# Altium schematic sheet PLL.SchDoc
size A4
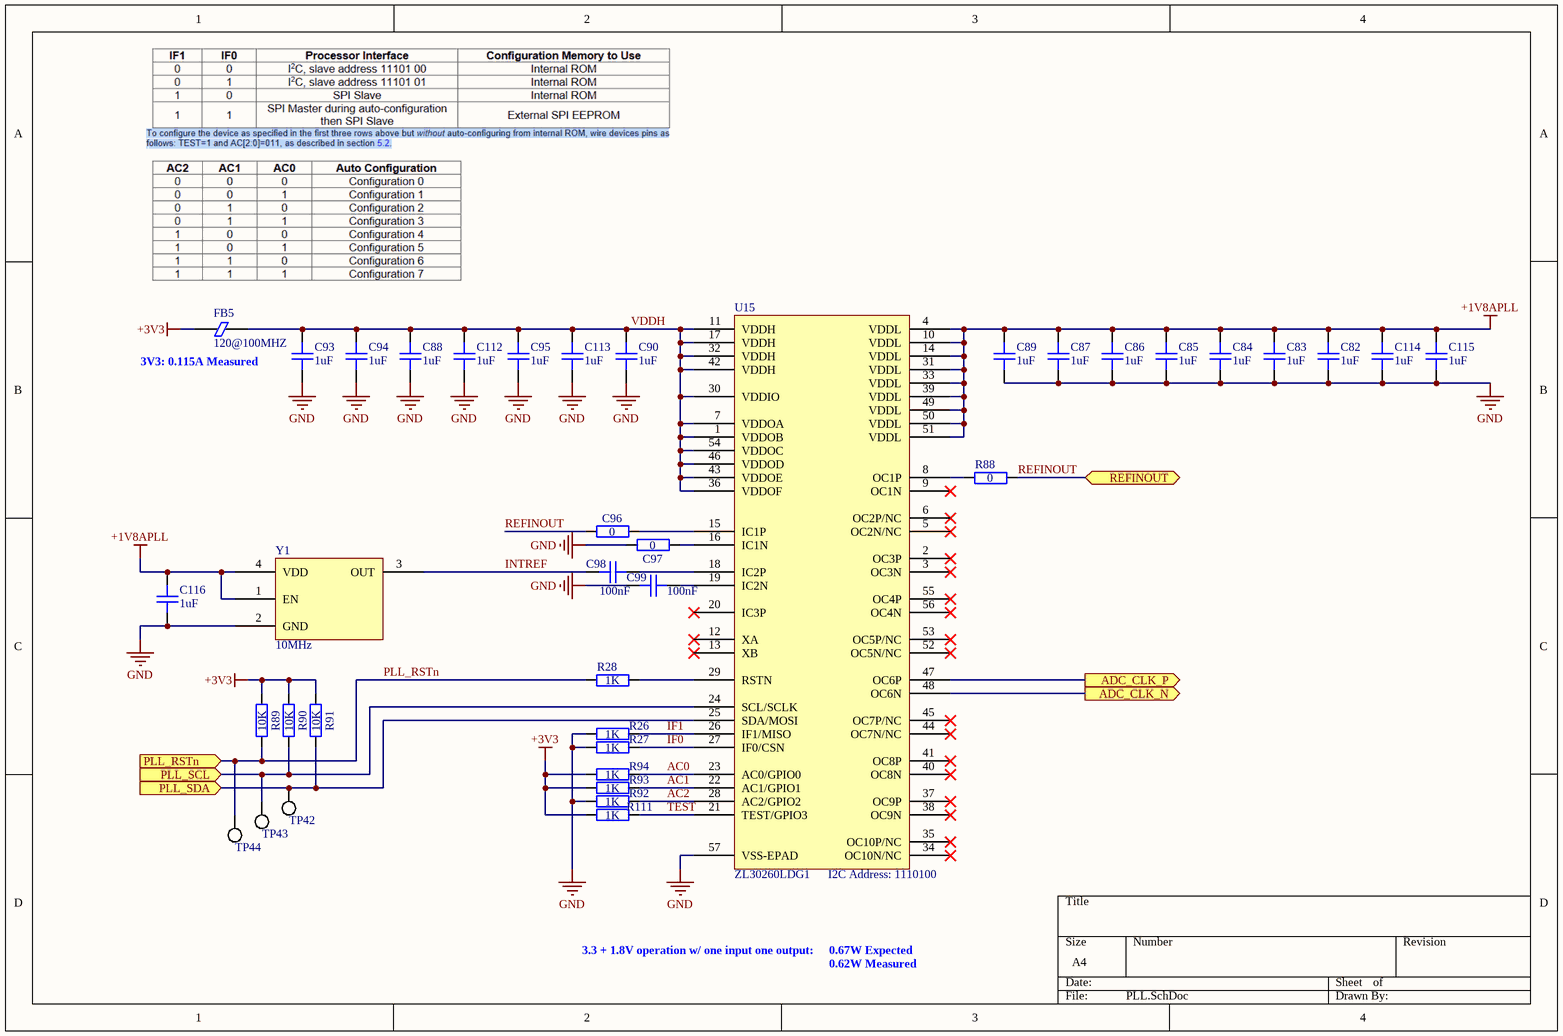
[diagram p0: PLL.SchDoc]

## Parts
C82  1uF  [GEN_C_0402]
C83  1uF  [GEN_C_0402]
C84  1uF  [GEN_C_0402]
C85  1uF  [GEN_C_0402]
C86  1uF  [GEN_C_0402]
C87  1uF  [GEN_C_0402]
C88  1uF  [GEN_C_0402]
C89  1uF  [GEN_C_0402]
C90  1uF  [GEN_C_0402]
C93  1uF  [GEN_C_0402]
C94  1uF  [GEN_C_0402]
C95  1uF  [GEN_C_0402]
C96  0  [GEN_R_0402]
C97  0  [GEN_R_0402]
C98  100nF  [GEN_C_0402]
C99  100nF  [GEN_C_0402]
C112  1uF  [GEN_C_0402]
C113  1uF  [GEN_C_0402]
C114  1uF  [GEN_C_0402]
C115  1uF  [GEN_C_0402]
C116  1uF  [GEN_C_0402]
FB5  120@100MHZ  [GEN_R_0402]
R26  1K  [GEN_R_0402]
R27  1K  [GEN_R_0402]
R28  1K  [GEN_R_0402]
R88  0  [GEN_R_0402]
R89  10K  [GEN_R_0402]
R90  10K  [GEN_R_0402]
R91  10K  [GEN_R_0402]
R92  1K  [GEN_R_0402]
R93  1K  [GEN_R_0402]
R94  1K  [GEN_R_0402]
R111  1K  [GEN_R_0402]
TP42  PCB  [GEN_TP_PCB]  (value not drawn)  (no BOM)
TP43  PCB  [GEN_TP_PCB]  (value not drawn)  (no BOM)
TP44  PCB  [GEN_TP_PCB]  (value not drawn)  (no BOM)
U15  ZL30260LDG1  [MC_QFN56_ZL30260]
Y1  10MHz  [ECS_TXO-3225]

## Ports
ADC_CLK_N (out), ADC_CLK_P (out), PLL_RSTn (in), PLL_SCL (in), PLL_SDA (in), REFINOUT (bidir)

## Nets
+1V8APLL: C82.1 C83.1 C84.1 C85.1 C86.1 C87.1 C89.1 C114.1 C115.1 C116.1 U15.4(VDDL) U15.10(VDDL) U15.14(VDDL) U15.31(VDDL) U15.33(VDDL) U15.39(VDDL) U15.49(VDDL) U15.50(VDDL) U15.51(VDDL) Y1.1(EN) Y1.4(VDD)
+3V3: FB5.1 R89.2 R90.2 R91.2 R93.1 R94.1 R111.1
GND: C82.2 C83.2 C84.2 C85.2 C86.2 C87.2 C88.2 C89.2 C90.2 C93.2 C94.2 C95.2 C97.2 C99.2 C112.2 C113.2 C114.2 C115.2 C116.2 R26.1 R27.1 R92.1 U15.57(VSS-EPAD) Y1.2(GND)
AC0: R94.2 U15.23(AC0/GPIO0)
AC1: R93.2 U15.22(AC1/GPIO1)
AC2: R92.2 U15.28(AC2/GPIO2)
ADC_CLK_N: U15.48(OC6N) ; port ADC_CLK_N
ADC_CLK_P: U15.47(OC6P) ; port ADC_CLK_P
IF0: R27.2 U15.27(IF0/CSN)
IF1: R26.2 U15.26(IF1/MISO)
INTREF: C98.2 Y1.3(OUT)
PLL_RSTn: R28.2 R89.1 TP44.1 ; port PLL_RSTn
PLL_SCL: R90.1 TP43.1 U15.24(SCL/SCLK) ; port PLL_SCL
PLL_SDA: R91.1 TP42.1 U15.25(SDA/MOSI) ; port PLL_SDA
REFINOUT: C96.2 R88.2 ; port REFINOUT
TEST: R111.2 U15.21(TEST/GPIO3)
VDDH: C88.1 C90.1 C93.1 C94.1 C95.1 C112.1 C113.1 FB5.2 U15.1(VDDOB) U15.7(VDDOA) U15.11(VDDH) U15.17(VDDH) U15.30(VDDIO) U15.32(VDDH) U15.36(VDDOF) U15.42(VDDH) U15.43(VDDOE) U15.46(VDDOD) U15.54(VDDOC)
NetC96_1: C96.1 U15.15(IC1P)
NetC97_1: C97.1 U15.16(IC1N)
NetC98_1: C98.1 U15.18(IC2P)
NetC99_1: C99.1 U15.19(IC2N)
NetR28_1: R28.1 U15.29(RSTN)
NetR88_1: R88.1 U15.8(OC1P)

Not connected (* = marked no-connect by the designer): U15 2(OC3P)* 3(OC3N)* 5(OC2N/NC)* 6(OC2P/NC)* 9(OC1N)* 12(XA)* 13(XB)* 20(IC3P)* 34(OC10N/NC)* 35(OC10P/NC)* 37(OC9P)* 38(OC9N)* 40(OC8N)* 41(OC8P)* 44(OC7N/NC)* 45(OC7P/NC)* 52(OC5N/NC)* 53(OC5P/NC)* 55(OC4P)* 56(OC4N)*

## Notes on the sheet
- 3V3: 0.115A Measured
- (near U15) I2C Address: 1110100
- 3.3 + 1.8V operation w/ one input one output:
- 0.62W Measured
- 0.67W Expected

## Library data of the parts
C82-C90 C93-C95 C112-C116 = CAP 1uF 25V X5R 0402: Voltage Rating: 25V; Package: 0402; Supplier 1: Digi-Key; Supplier Part Number 1: 490-10017-1-ND; Value: 1uF
C96 C97 = RES 0 OHM 1/16W 0402: Manufacturer: Yageo; Manufacturer Part Number: RC0402JR-070RL; Package: 0402; Supplier 1: Digi-Key; Supplier Part Number 1: 311-0.0JRCT-ND; Value: 0
C98 C99 = CAP 100nF 16V X7R 0402: Voltage Rating: 16V; Package: 0402; Supplier 1: Digi-Key; Supplier Part Number 1: 490-4759-1-ND; Value: 100nF
FB5 = FERRITE BEAD 120 OHM 0402: Supplier 1: Digi-Key; Supplier Part Number 1: 490-9656-1-ND
R26-R28 R92-R94 R111 = RES 1K OHM 1% 1/10W 0402: Manufacturer: Yageo; House Part Number: R-1K-0402-1%-001; Manufacturer Part Number: RC0402FR-071KL; Tolerance: 1%; Package: 0402; Supplier 1: Digi-Key; Supplier Part Number 1: 311-1.00KLRCT-ND; Value: 1K
R88 = RES 0 OHM 1/16W 0402: Power Rating: 0.0625W; Package: 0402; Supplier 1: Digi-Key; Supplier Part Number 1: 311-0.0JRCT-ND; Value: 0
R89-R91 = RES 10K OHM 1% 1/10W 0402: Tolerance: 1%; Power Rating: 0.1W; Package: 0402; Supplier 1: Digi-Key; Supplier Part Number 1: P10.0KLCT-ND; Value: 10K
TP42-TP44 = TP PCB 1mm
U15 = IC CLK GEN ZL30260LDG1: Manufacturer: Microchip; Manufacturer Part Number: ZL30260LDG1; Supplier 1: Mouser; Supplier Part Number 1: 494-ZL30260LDG1
Y1 = OSC 10MHz ECS-TXO-3225MV: Supplier 1: Digi-Key; Supplier Part Number 1: 50-ECS-TXO-3225MV-100-CT-ND